# Altium schematic sheet Sensors.SchDoc: MEGAPHONE Sensors
size A4; DrawnBy: D Kleiss; Organization: Flinders University; Address1: College of Science & Engineering; Address2: Engineering Services Room 3.22; Address3: 1284 South Rd; Address4: SA 5042; DocumentNumber: A4284; Revision: 1; SheetNumber: 5; SheetTotal: 15
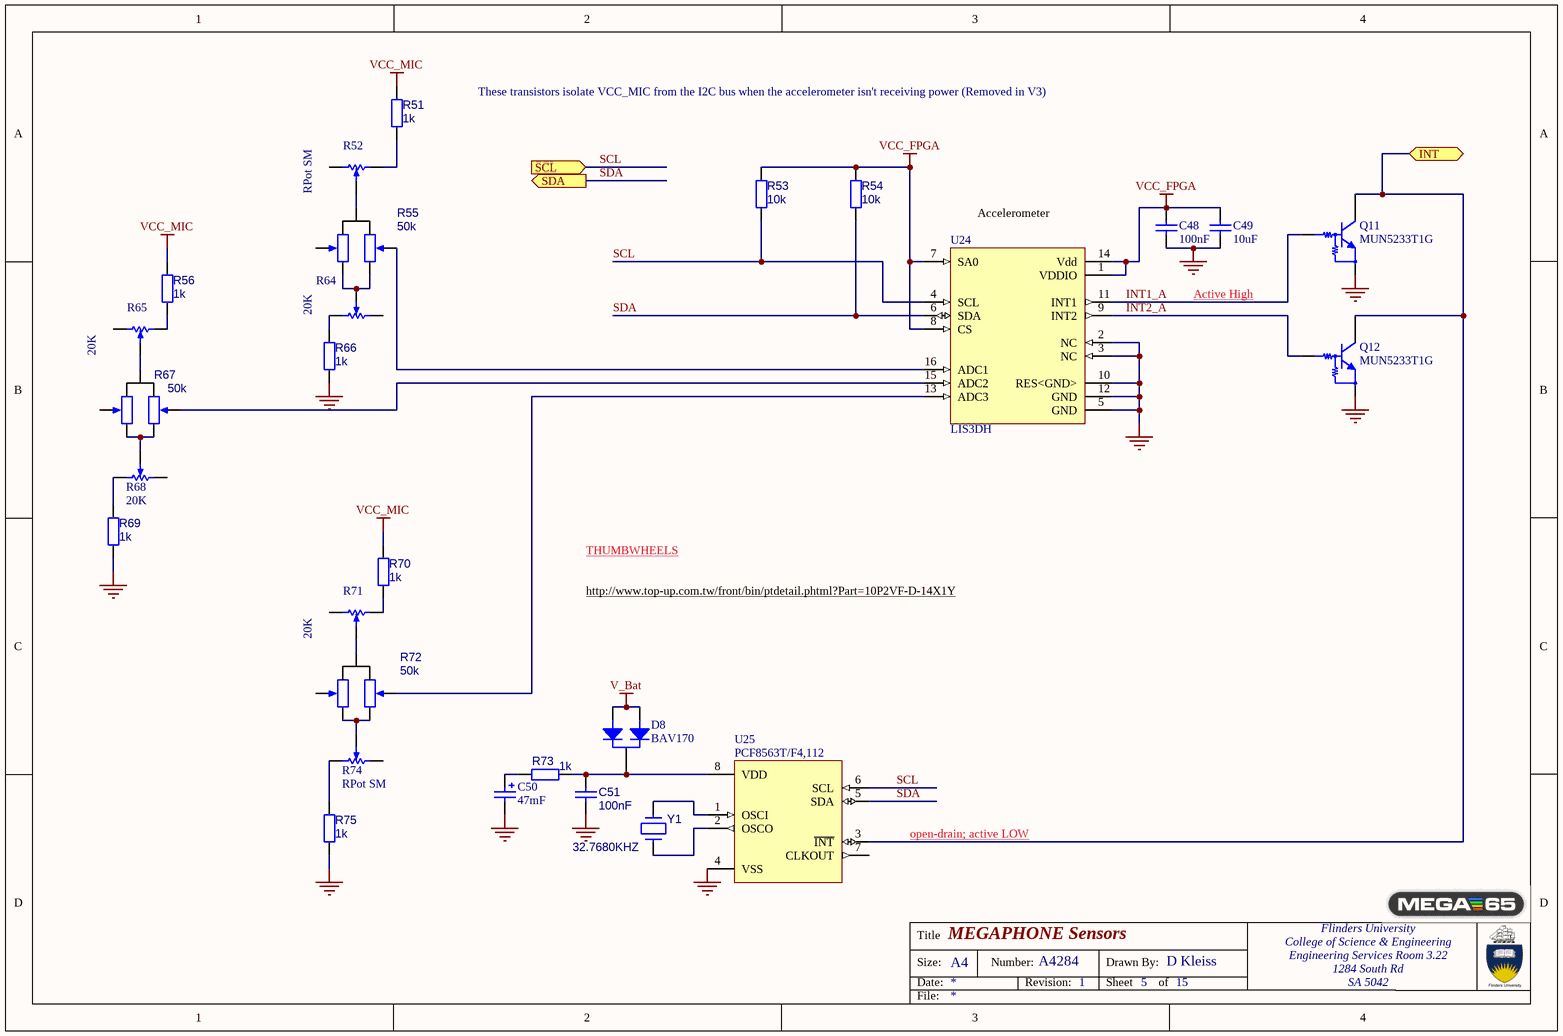
[diagram p0: Sensors.SchDoc]

## Parts
C48  100nF  [CAPC0805(2012)100_N]
C49  10uF  [CAPC0805(2012)100_N]
C50  47mF  [CAP SMD 10.5D 5.5H]
C51  100nF  [0603_CAP UF HD]
D8  BAV170  [SOT-23]
Q11  MUN5233T1G  [SC70-3 (SOT-323)]
Q12  MUN5233T1G  [SC70-3 (SOT-323)]
R51  1k  [0603-RESISTOR HD]
R52  RPot SM  [POT4MM-2]
R53  10k  [0603-RESISTOR HD]
R54  10k  [0603-RESISTOR HD]
R55  50k  [POT 10P2VF-D-141Y]
R56  1k  [0603-RESISTOR HD]
R64  20K  [POT4MM-2]
R65  20K  [POT4MM-2]
R66  1k  [0603-RESISTOR HD]
R67  50k  [POT 10P2VF-D-141Y]
R68  20K  [POT4MM-2]
R69  1k  [0603-RESISTOR HD]
R70  1k  [0603-RESISTOR HD]
R71  20K  [POT4MM-2]
R72  50k  [POT 10P2VF-D-141Y]
R73  1k  [0603-RESISTOR HD]
R74  RPot SM  [POT4MM-2]
R75  1k  [0603-RESISTOR HD]
U24  LIS3DH  [LGA-16_3x3x1mm]
U25  PCF8563T/F4,112  [SOIC-8-H_SLDR]
Y1  32.7680KHZ  [FC-135]

## Ports
INT (bidir), SCL (in), SDA (out)

## Nets
GND: C48.2 C49.2 C50.2 C51.2 Q11.1(E) Q12.1(E) R66.2 R69.2 R75.2 U24.2(NC) U24.3(NC) U24.5(GND) U24.10(RES<GND>) U24.12(GND) U25.4(VSS)
V_Bat: D8.1(A1) D8.2(A2)
VCC_FPGA: C48.1 C49.1 R53.1 R54.1 U24.1(VDDIO) U24.7(SA0) U24.8(CS) U24.14(Vdd)
VCC_MIC: R51.1 R56.1 R70.1
INT: Q11.3(C) Q12.3(C) U25.3(~{INT}) ; port INT
INT1_A: Q11.2(B) U24.11(INT1)
INT2_A: Q12.2(B) U24.9(INT2)
SCL: R53.2 U24.4(SCL) U25.6(SCL) ; port SCL
SDA: R54.2 U24.6(SDA) U25.5(SDA) ; port SDA
NetC50_1: C50.1 R73.2
NetC51_1: C51.1 D8.3(K) R73.1 U25.8(VDD)
NetR51_2: R51.2 R52.CW(+)
NetR52_W: R52.W R55.1
NetR55_2A: R55.2A U24.16(ADC1)
NetR55_3A: R55.3A R55.3B R64.W
NetR56_2: R56.2 R65.CW(+)
NetR64_CW: R64.CW(+) R66.1
NetR65_W: R65.W R67.1
NetR67_2A: R67.2A U24.15(ADC2)
NetR67_3A: R67.3A R67.3B R68.W
NetR68_CW: R68.CW(+) R69.1
NetR70_2: R70.2 R71.CW(+)
NetR71_W: R71.W R72.1
NetR72_2A: R72.2A U24.13(ADC3)
NetR72_3A: R72.3A R72.3B R74.W
NetR74_CW: R74.CW(+) R75.1
NetU25_1: U25.1(OSCI) Y1.2
NetU25_2: U25.2(OSCO) Y1.1

Not connected (* = marked no-connect by the designer): R52 CCW(-); R55 2B; R64 CCW(-); R65 CCW(-); R67 2B; R68 CCW(-); R71 CCW(-); R72 2B; R74 CCW(-); U25 7(CLKOUT)

## Notes on the sheet
- These transistors isolate VCC_MIC from the I2C bus when the accelerometer isn't receiving power (Removed in V3)
- (near U24) Accelerometer
- Active High
- THUMBWHEELS
- http://www.top-up.com.tw/front/bin/ptdetail.phtml?Part=10P2VF-D-14X1Y
- open-drain; active LOW
- Title
- Size:
- Date:
- A4
- Number:
- Revision:
- Sheet
- Drawn By:
- of
- File:

## Library data of the parts
C48 C49 = CMP-1036-01531-1: 0805 (2012 Metric); Tolerance: Â±2%; Rated Voltage: 100 V; Case-Metric: 2012; Case-EIA: 0805; Value: 39pF; Technology: SMT; Max Thickness: 1 mm
C50 = Cap Pol: Polarized Capacitor (Radial); Manufacturer: KEMET; Manufacturer Number: FC0H473ZFTBR24; Value: 47mF; Digikey Number: 399-10938-1-ND
C51 = Cap: Capacitor; Value: 100nF
D8 = BAV170: Dual Common Cathode Silicon Low Leakage Diode 3-Pin SOT-23; Manufacturer: Infineon Technologies; Manufacturer Number: BAV170E6327HTSA1; Digikey Number: BAV170E6327HTSA1CT-ND
Q11 Q12 = Transistor NPN Prebiased: NPN Bipolar Transistor, Prebiased; Manufacturer: ON Semiconductor; Manufacturer Number: MUN5233T1G; Digikey Number: MUN5233T1GOSCT-ND
R51 R53 R54 R56 R66 R69 R70 R73 R75 = Resistor
  R51 R56 R66 R69 R70 R73 R75: Value: 1k
  R53 R54: Value: 10k
R52 R64 R65 R68 R71 R74 = RPot SM: Square Trimming Potentiometer; Published: 17-Dec-2003; DatasheetVersion: Oct-2003; PackageReference: POT4MM-2; Publisher: Altium Limited; PackageDescription: Square Trimming Potentiometer; ComponentLink1Description: Manufacturer Link; ComponentLink1URL: http://bourns.com/2/search.html
R55 R67 R72 = Resistor Potentiometer Dual: Resistor; Manufacturer: TOP UP Industry; Manufacturer Number: 10P2VF-D-14X1Y; Value: 50k
U24 = LIS3DH: Accelerometer; Digikey Number: 497-10610-ND
U25 = PCF8563T/F4,112: PCF8563 Series 1.8 - 5.5 V 250 mA Real-time Clock/Calendar - SOIC-8
Y1 = CRYSTAL: Manufacturer: EPSON; Manufacturer Number: FC-135R 32.7680KA-AG3; Value: 32.7680KHZ; Digikey Number: SER4073CT-ND